# EAGLE design DRA818V_breakout_board (EAGLE 9.5.2)
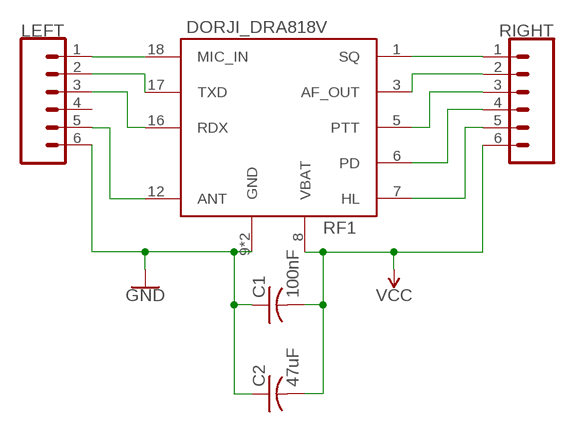
[diagram p0: schematic, sheet 1]

## Parts
C1  100nF  C-USC0603  [C0603]
C2  47uF  C-USC0603  [C0603]
LEFT  CONN_06NO_SILK_FEMALE_PTH  [1X06_NO_SILK]
RF1  DORJI_DRA818V  [DORJI_DRA818V]
RIGHT  CONN_06NO_SILK_FEMALE_PTH  [1X06_NO_SILK]

## Nets
GND: C1.1 C2.1 LEFT.6 RF1.9(GND) RF1.10(GND)
N$2: RF1.7(HL) RIGHT.5
N$4: RF1.6(PD) RIGHT.4
N$5: RF1.5(PTT) RIGHT.3
N$6: RF1.3(AF_OUT) RIGHT.2
N$7: RF1.1(SQ) RIGHT.1
N$8: LEFT.5 RF1.12(ANT)
N$9: LEFT.1 RF1.18(MIC_IN)
N$10: LEFT.2 RF1.17(TXD)
N$11: LEFT.3 RF1.16(RDX)
VCC: C1.2 C2.2 RF1.8(VBAT) RIGHT.6
Unconnected: LEFT.4

## Library data of the parts
C1 C2 = rcl:C-US: CAPACITOR, American symbol
LEFT RIGHT = SparkFun-Connectors:CONN_06: Multi connection point. Often used as Generic Header-pin footprint for 0.1 inch spaced/style header connections On any of the 0.1 inch spaced packages, you can populate with these: Break Away Headers - Straight <https://www.sparkfun.com/products/116> (PRT-00116) Break Away Male Headers - Right Angle <https://www.sparkfun.com/products/553> (PRT-00553) Female Headers <https://www.sparkfun.com/products/115> (PRT-00115) Break Away Headers - Machine Pin <https://www.sparkfun.com/products/117> (PRT-00117) Break Away Female Headers - Swiss Machine Pin <https://www.sparkfun.com/products/743> (PRT-00743) Arduino Stackable Header - 6 Pin <https://www.sparkfun.com/products/9280> (PRT-09280) For SCREWTERMINALS and SPRING TERMINALS visit here: Screw Terimnals on SparkFun.com <https://www.sparkfun.com/search/results?term=Screw+Terminals> (5mm/3.5mm/2.54mm spacing) This device is also useful as a general connection point to wire up your design to another part of your project. Our various solder wires solder well into these plated through hole pads. Hook-Up Wire - Assortment (Stranded, 22 AWG) <https://www.sparkfun.com/products/11375> (PRT-11375) Hook-Up Wire - Assortment (Solid Core, 22 AWG) <https://www.sparkfun.com/products/11367> (PRT-11367) View the entire wire category on our website here <https://www.sparkfun.com/categories/141>; PROD_ID: CONN-08437
RF1 = DORJI_DRA818V:DORJI_DRA818V: Dorji DRA818V VHF Band Voice Transceiver Module

## Board
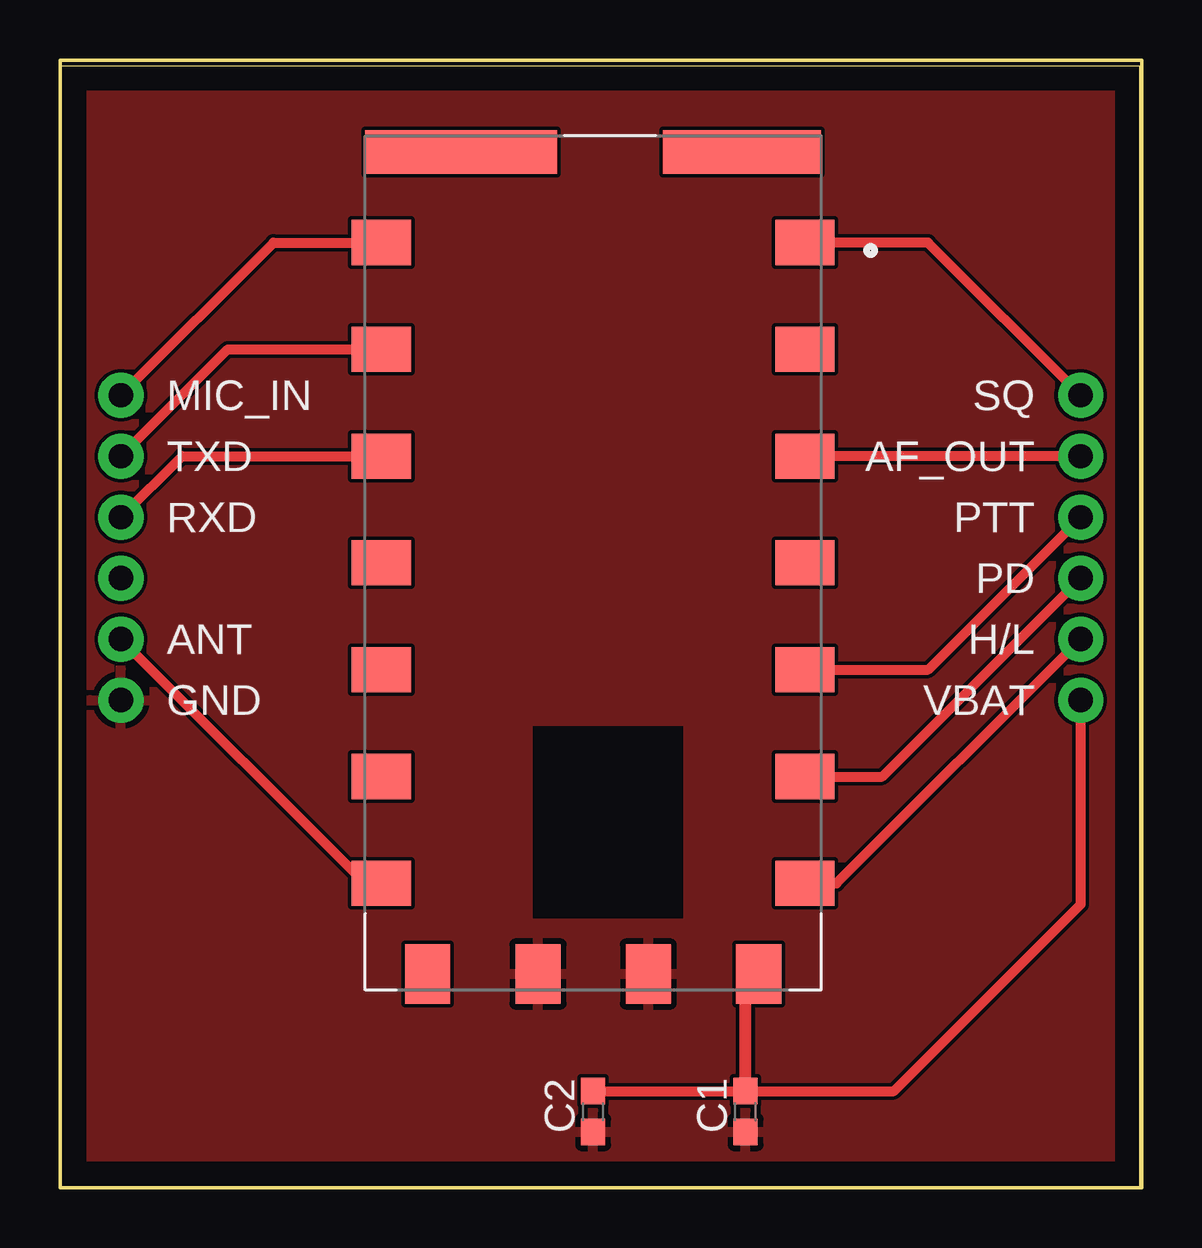
[diagram p1: board, top side]

Size 45.09 x 46.99 mm. Coordinates in mm from the lower left corner, seen from the top.
Outline: 45.09,0 45.01,0 45.01,46.73 0,46.73 0,46.99
Outline: 45.09,0 45.09,46.99 0,46.99
Outline: 45.09,0 0,0 0,46.99
Copper layers (1*16): Top 0.035mm / dielectric 1.5mm / Bottom 0.035mm
Design rules "default": minimum track width 6mil, minimum drill 0.35mm, track to track 6mil, track to pad 6mil, pad to pad 6mil, via to via 6mil, smd to smd 6mil, copper to edge 40mil, drill to drill 6mil, minimum pad ring 10mil, minimum via ring 8mil, stop-mask expansion 4mil, vias tented up to drill 0mil, thermal gap 10mil

### Footprints (pad centres in the part's own frame; a part is rotated, then mirrored left to right if it is on the bottom)
C0603 = smd 1.1 x 1: 1 -0.85,0; 2 0.85,0
1X06_NO_SILK = drill 1.016 pad 1.88: 1 0,0; 2 2.54,0; 3 5.08,0; 4 7.62,0; 5 10.16,0; 6 12.7,0
DORJI_DRA818V = smd 2.47 x 1.88: 1 -2.605,4.46; 2 -2.605,0.01; 3 -2.605,-4.44; 4 -2.605,-8.89; 5 -2.605,-13.34; 6 -2.605,-17.79; 7 -2.605,-22.24; 12 -20.255,-22.24; 13 -20.255,-17.79; 14 -20.255,-13.34; 15 -20.255,-8.89; 16 -20.255,-4.44; 17 -20.255,0.01; 18 -20.255,4.46 | smd 1.88 x 2.47: 8 -4.53,-26.015; 9 -9.13,-26.015; 10 -13.73,-26.015; 11 -18.33,-26.015 | smd 6.6 x 1.8: P2 -5.23,8.235 | smd 8 x 1.8: P3 -16.93,8.235

### Placement (x,y rotation side)
C1  28.57,3.17 90 top
C2  22.23,3.17 90 top
LEFT  2.54,33.02 270 top
RF1  33.66,34.92 0 top
RIGHT  42.55,33.02 270 top

### Tracks (layer width: path | path; a pad name or v marks a point on that pad's centre or on a via)
GND
  pour Top: -1.27,47.62 46.35,47.62 46.35,-1.27 -1.27,-1.27
N$2
  Top 0.406: RF1.7 32.37,12.69 RIGHT.5
  Top 0.508: RF1.7 31.05,13.27
N$4
  Top 0.406: RF1.6 34.28,17.14 RIGHT.4
N$5
  Top 0.406: RF1.5 36.19,21.59 RIGHT.3
  Top 0.508: 31.75,21.59 RF1.5
N$6
  Top 0.406: RIGHT.2 RF1.3
  Top 0.508: 31.69,29.84 RF1.3
N$7
  Top 0.406: RIGHT.1 36.18,39.38 RF1.1
  Top 0.508: 31.05,38.8 RF1.1
N$8
  Top 0.406: RF1.12 12.71,12.69 LEFT.5
N$9
  Top 0.406: LEFT.1 8.9,39.38 RF1.18
  Top 0.508: 13.4,38.8 RF1.18
N$10
  Top 0.406: LEFT.2 7,34.94 RF1.17
N$11
  Top 0.406: LEFT.3 5.08,30.48 RF1.16
VCC
  Top 0.406: C2.2 C1.2 34.76,4.03 42.55,11.81 RIGHT.6
  Top 0.508: C1.2 28.57,8.36 RF1.8

### Text on the board
tNames: MIC_IN | SQ | TXD | AF_OUT | RXD | PTT | PD | ANT | H/L | GND | VBAT